# EAGLE design untitled (EAGLE 7.5.0)
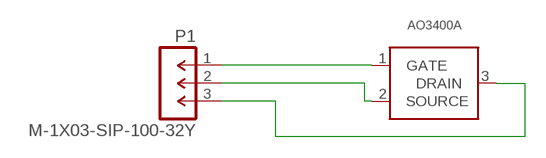
[diagram p0: schematic, sheet 1]

## Parts
P1  M-1X03-SIP-100-32Y  [SIP-100-03-32Y]
U$1  AO3400A  [SOT-23]

## Nets
N$1: P1.1 U$1.1(GATE)
N$2: P1.2 U$1.2(SOURCE)
N$3: P1.3 U$1.3(DRAIN)

## Library data of the parts
P1 = con-headers-jp:M-1X03-: MALE HEADER
U$1 = smd-footprints:AO3400A

## Board
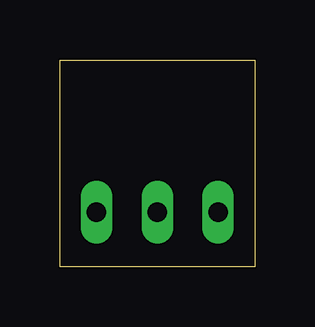
[diagram p1: board, top side]
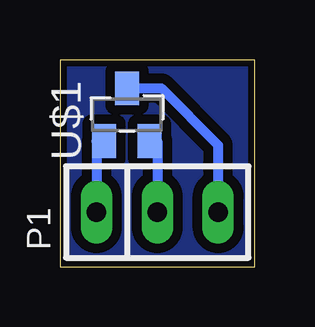
[diagram p2: board, bottom side, seen from below]

Size 8.13 x 8.64 mm. Coordinates in mm from the lower left corner, seen from the top.
Outline: 0,8.64 8.13,8.64 8.13,0 0,0 0,8.64
Copper layers (1*16): Top 0.035mm / dielectric 1.5mm / Bottom 0.035mm
Design rules "default 16mils": minimum track width 10mil, minimum drill 24mil, track to track 16mil, track to pad 16mil, pad to pad 16mil, via to via 16mil, smd to smd 10mil, copper to edge 10mil, drill to drill 10mil, minimum pad ring 10mil, minimum via ring 8mil, stop-mask expansion 4mil, vias tented up to drill 0mil, thermal gap 12mil

### Footprints (pad centres in the part's own frame; a part is rotated, then mirrored left to right if it is on the bottom)
SIP-100-03-32Y = drill 0.813 long: 1 -2.54,0; 2 0,0; 3 2.54,0
SOT-23 = smd 1 x 1.4: 1 -0.95,-1.1; 2 0.95,-1.1; 3 0,1.1

### Placement (x,y rotation side)
P1  4.06,2.29 0 bottom
U$1  5.33,6.35 0 bottom

### Tracks (layer width: path | path; a pad name or v marks a point on that pad's centre or on a via)
N$1
  Bottom 0.406: U$1.1 6.6,5.25 P1.1
N$2
  Bottom 0.406: U$1.2 4.06,5.25 P1.2
N$3
  Bottom 0.406: U$1.3 3.89,7.45 1.52,5.08 P1.3
N$4
  pour Bottom: 0,8.64 8.13,8.64 8.13,0 0,0